# Altium schematic sheet TP_IHM_POWER.SchDoc
size A4
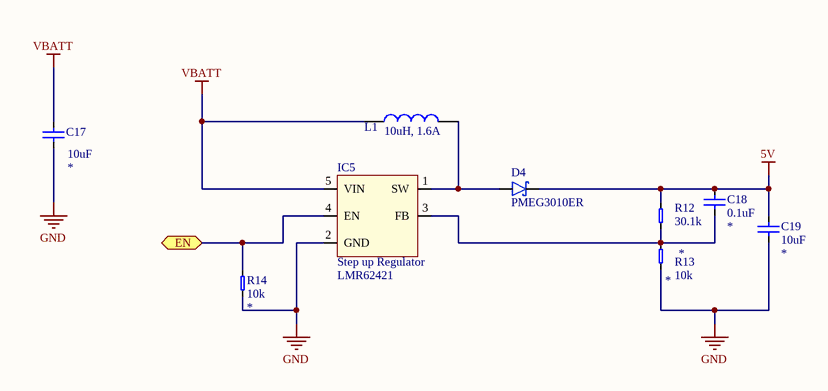
[diagram p0: TP_IHM_POWER.SchDoc]

## Parts
C17  value 10uF  [0603_CAP_LD]  (hidden comment: CerCap)
C18  value 0.1uF  [0603_CAP_LD]  (hidden comment: CerCap)
C19  value 10uF  [0603_CAP_LD]  (hidden comment: CerCap)
D4  PMEG3010ER  [SOD123W]
IC5  Step up Regulator  [LMR62421]
L1  10uH, 1.6A  [INDUCTOR_WE-LQS_5020]
R12  value 30.1k  [0603_RES_LD]  (hidden comment: Resistor)
R13  value 10k  [0603_RES_LD]  (hidden comment: Resistor)
R14  value 10k  [0603_RES_LD]  (hidden comment: Resistor)

## Ports
EN

## Nets
5V: C18.2 C19.2 D4.K R12.2
GND: C17.1 C19.1 IC5.2(GND) R13.1 R14.1
VBATT: C17.2 IC5.5(VIN) L1.1
EN: IC5.4(EN) R14.2 ; port EN
NetC18_1: C18.1 IC5.3(FB) R12.1 R13.2
NetD4_A: D4.A IC5.1(SW) L1.2

## Library data of the parts
C17-C19 = CerCap: Ceramic Capacitor; Type: *; Voltage/Power: *; Package: *
D4 = Schottky_PMEG3010ER: Nexperia 1A low Vf Mega Schottky barrier rectifier; Reference: PMEG3010ER
IC5 = LMR62421XMF: LMR62421 simple switcher 24 Vout stepup voltage SOT-23; Reference: LMR62421
L1 = INDUCTOR_74404052100: WE-LQS SMD Power Inductor, size 5020, 10uH, 1.6A; DC Resistance: 109mOhm; Inductance Tolerance: +/-20%; Saturation Current: 1.95A; Self Resonant Frequency: 37MHz; ComponentLink1Description: Manufacturer; ComponentLink1URL: http://www.we-online.de; ComponentLink2Description: Datasheet; ComponentLink2URL: https://katalog.we-online.com/pbs/datasheet/74404052100.pdf; Part Number: 74404052100; Published Date: May 2019; Publisher: Wurth Elektronik; Rated Current: 1.6A; Inductance: 10uH; Operating Temperature: -40 to +125degC; Mounting Technology: SMT; Packaging: Tape and Reel; DC Resistance Tolerance: +/-20%; Size: 5020; Reference: 74404052100
R12-R14 = Resistor: Precision: *; Package: *